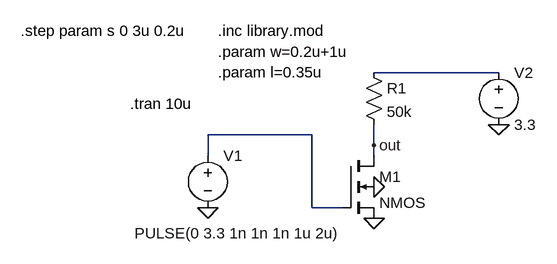
[diagram p0: schematic quiz7.asc]
quiz7.asc, the LTspice schematic file:
Version 4
SHEET 1 1172 680
WIRE 928 32 736 32
WIRE 640 128 480 128
WIRE 736 144 736 112
WIRE 480 160 480 128
WIRE 736 160 736 144
WIRE 640 240 640 128
WIRE 688 240 640 240
FLAG 736 256 0
FLAG 736 208 0
FLAG 480 240 0
FLAG 928 112 0
FLAG 736 144 out
SYMBOL voltage 480 144 R0
WINDOW 3 -113 135 Left 2
WINDOW 123 0 0 Left 0
WINDOW 39 0 0 Left 0
SYMATTR Value PULSE(0 3.3 1n 1n 1n 1u 2u)
SYMATTR InstName V1
SYMBOL voltage 928 16 R0
WINDOW 123 0 0 Left 0
WINDOW 39 0 0 Left 0
SYMATTR InstName V2
SYMATTR Value 3.3
SYMBOL nmos4 688 160 R0
SYMATTR InstName M1
SYMATTR Value2 l=l w=w
SYMBOL res 720 16 R0
SYMATTR InstName R1
SYMATTR Value 50k
TEXT 496 -32 Left 2 !.inc library.mod
TEXT 360 80 Left 2 !.tran 10u
TEXT 496 0 Left 2 !.param w=0.2u+1u\n.param l=0.35u
TEXT 192 -32 Left 2 !.step param s 0 3u 0.2u

The netlist it stands for:
* quiz7.asc
V1 N002 0 PULSE(0 3.3 1n 1n 1n 1u 2u)
V2 N001 0 3.3
M1 out N002 0 0 NMOS l=l w=w
R1 N001 out 50k
.model NMOS NMOS
.model PMOS PMOS
.lib standard.mos
.inc library.mod
.tran 10u
.param w=0.2u+1u
.param l=0.35u
.step param s 0 3u 0.2u
.backanno
.end

* Results of the author's LTspice run, read from the files saved beside the schematic
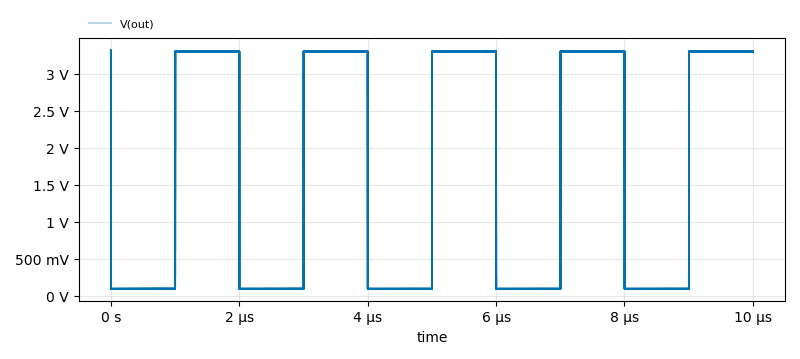
[diagram p1: Transient Analysis of quiz7.asc, plotted from the saved traces]
* Transient Analysis, 16 runs:
*   V(out) [s=0]: min 93.77 mV, max 3.316 V, average 1.695 V, rms 2.333 V, last 3.3 V
*   V(out) [s=2e-07]: min 93.77 mV, max 3.316 V, average 1.695 V, rms 2.333 V, last 3.3 V
*   V(out) [s=4e-07]: min 93.77 mV, max 3.316 V, average 1.695 V, rms 2.333 V, last 3.3 V
*   V(out) [s=6e-07]: min 93.77 mV, max 3.316 V, average 1.695 V, rms 2.333 V, last 3.3 V
*   V(out) [s=8e-07]: min 93.77 mV, max 3.316 V, average 1.695 V, rms 2.333 V, last 3.3 V
*   V(out) [s=1e-06]: min 93.77 mV, max 3.316 V, average 1.695 V, rms 2.333 V, last 3.3 V
*   V(out) [s=1.2e-06]: min 93.77 mV, max 3.316 V, average 1.695 V, rms 2.333 V, last 3.3 V
*   V(out) [s=1.4e-06]: min 93.77 mV, max 3.316 V, average 1.695 V, rms 2.333 V, last 3.3 V